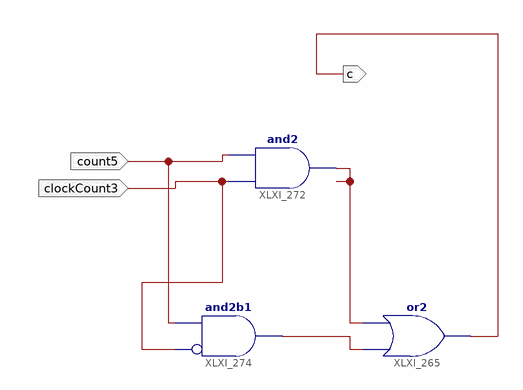
[diagram p0: schematic sheet 1]
// Xilinx ISE schematic BOOBOO_EN.sch (spartan3e) as structural Verilog: 3 symbols, 3 ports
module BOOBOO_EN (
  input  count5,
  input  clockCount3,
  output c
);

  wire XLXN_967, XLXN_969;

  or XLXI_265 (c, XLXN_969, XLXN_967);
  and XLXI_272 (XLXN_967, clockCount3, count5);
  and XLXI_274 (XLXN_969, ~clockCount3, count5);  // and2b1
endmodule
